# Altium schematic sheet 1_P1.schdoc
size 309 x 223 mm; Symbol: Sheet-Symbol_A4; Device: Sheet-Symbol_A4; @Page Name: P1; @Create Date: 2023-04-10; @Page Count: 1; @Page No: 1; @Project Name: CAN底盘舵机小车（步进云台）; @Schematic Name: Schematic1; @Update Date: 2023-05-09; Company: 嘉立创EDA; Page Size: A4; Version: V1.0
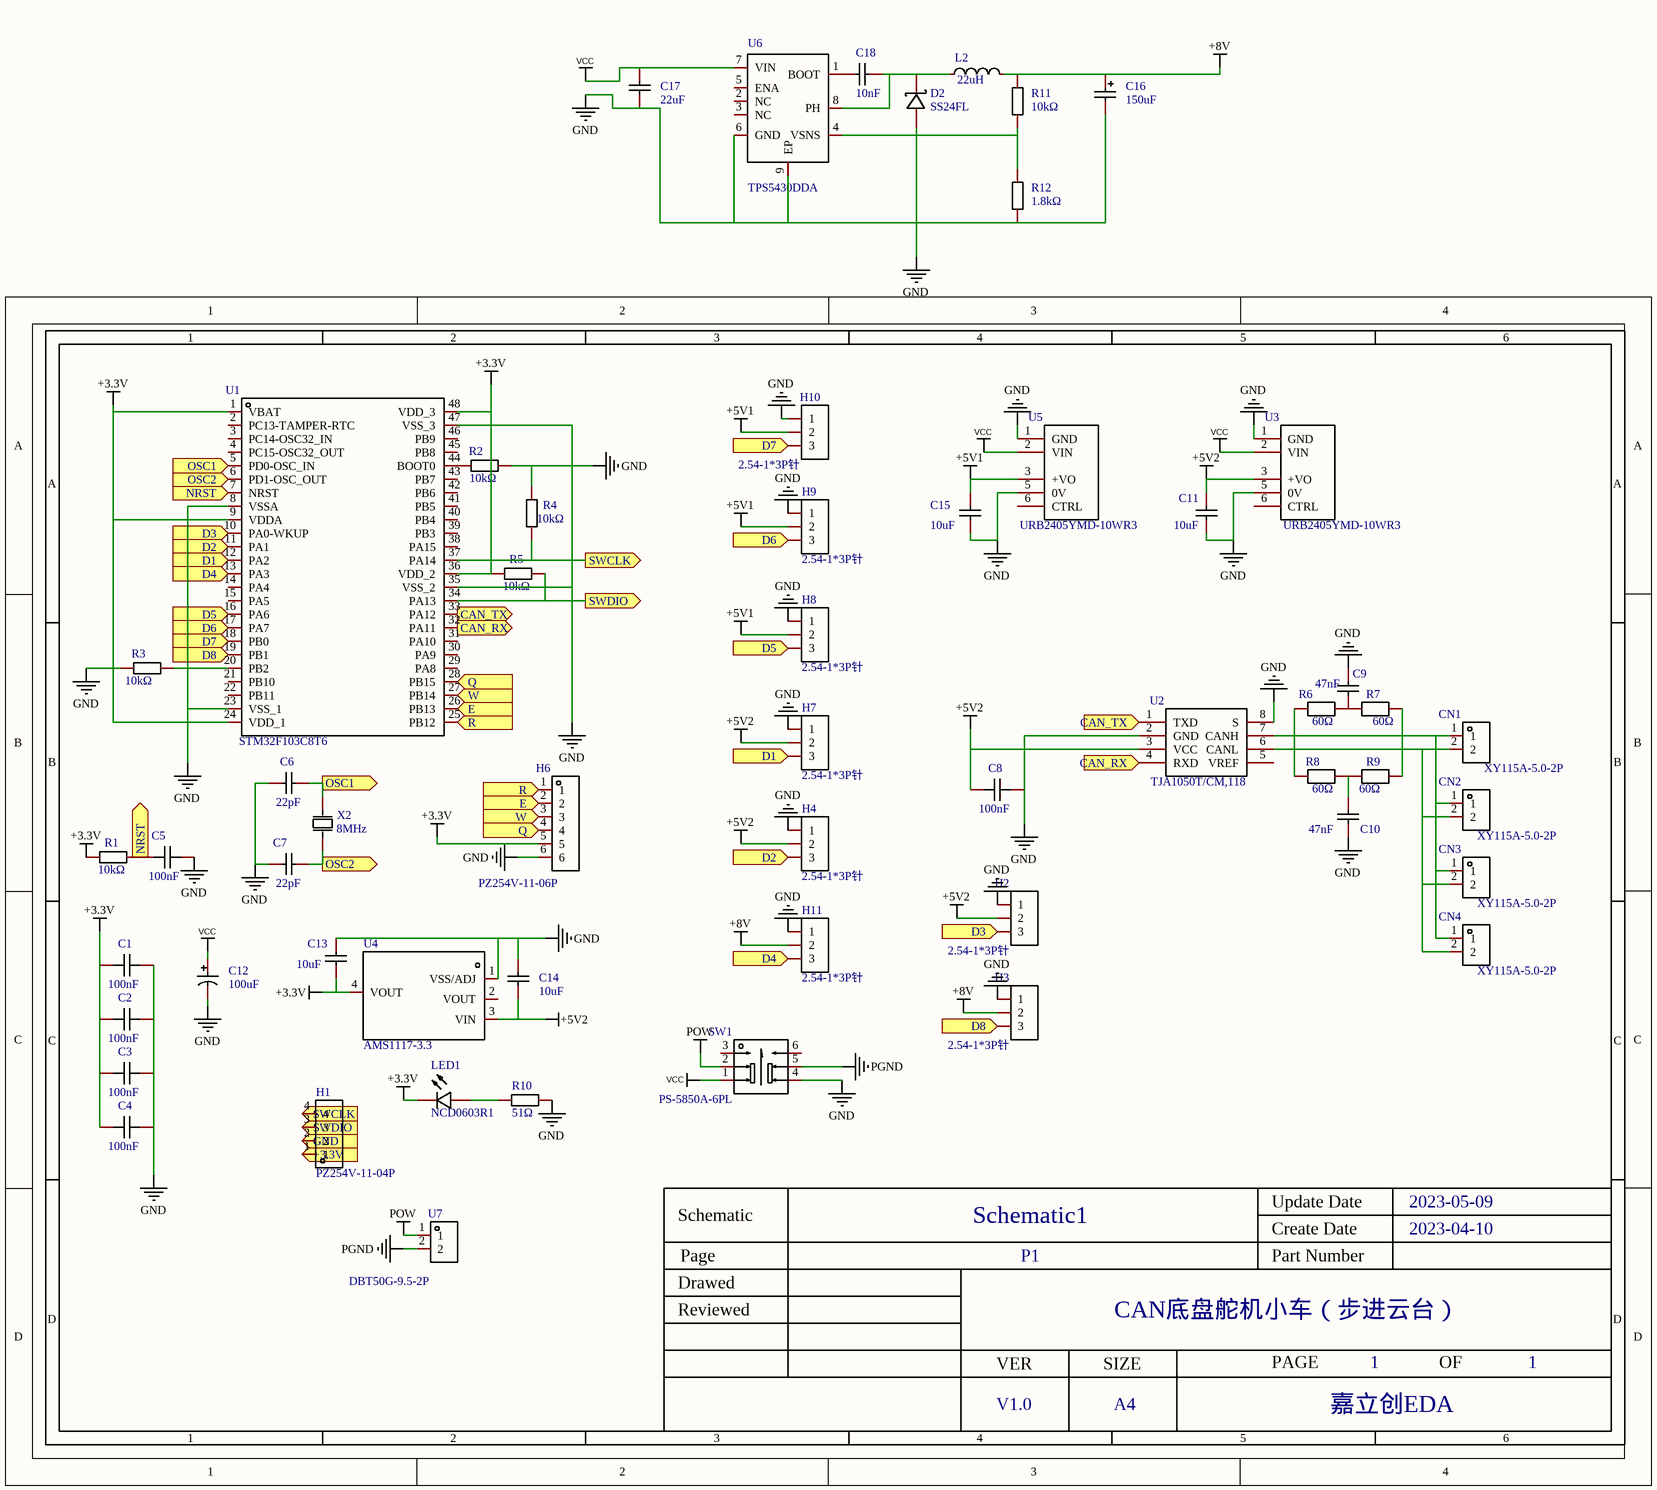
[diagram p0: 1_P1.schdoc]

## Parts
C1  100nF  [C0603]
C2  100nF  [C0603]
C3  100nF  [C0603]
C4  100nF  [C0603]
C5  100nF  [C0603]
C6  22pF  [C0603]
C7  22pF  [C0603]
C8  100nF  [C0603]
C9  47nF  [C0603]
C10  47nF  [C0603]
C11  10uF  [C1206]
C12  100uF  [CAP-TH_BD8.0-P3.50-D0.6-FD]
C13  10uF  [C1206]
C14  10uF  [C1206]
C15  10uF  [C1206]
C16  150uF  [CASE-D_7343]
C17  22uF  [C1206]
C18  10nF  [C0603]
CN1  XY115A-5.0-2P  [CONN-TH_XY115A-5.0-2P]
CN2  XY115A-5.0-2P  [CONN-TH_XY115A-5.0-2P]
CN3  XY115A-5.0-2P  [CONN-TH_XY115A-5.0-2P]
CN4  XY115A-5.0-2P  [CONN-TH_XY115A-5.0-2P]
D2  SS24FL  [SMA_L4.4-W2.8-LS5.4-RD]
H1  PZ254V-11-04P  [HDR-TH_4P-P2.54-V-M]
H2  2.54-1*3P针  [HDR-TH_3P-P2.54-V-M-1]
H3  2.54-1*3P针  [HDR-TH_3P-P2.54-V-M-1]
H4  2.54-1*3P针  [HDR-TH_3P-P2.54-V-M-1]
H6  PZ254V-11-06P  [HDR-TH_6P-P2.54-V-M]
H7  2.54-1*3P针  [HDR-TH_3P-P2.54-V-M-1]
H8  2.54-1*3P针  [HDR-TH_3P-P2.54-V-M-1]
H9  2.54-1*3P针  [HDR-TH_3P-P2.54-V-M-1]
H10  2.54-1*3P针  [HDR-TH_3P-P2.54-V-M-1]
H11  2.54-1*3P针  [HDR-TH_3P-P2.54-V-M-1]
L2  22uH  [IND-SMD_L11.5-W10.0_FXL1040]
LED1  NCD0603R1  [LED0603-FD]
R1  10kΩ  [R0603]
R2  10kΩ  [R0603]
R3  10kΩ  [R0603]
R4  10kΩ  [R0603]
R5  10kΩ  [R0603]
R6  60Ω  [R0603]
R7  60Ω  [R0603]
R8  60Ω  [R0603]
R9  60Ω  [R0603]
R10  51Ω  [R0603]
R11  10kΩ  [R0603]
R12  1.8kΩ  [R0805]
SW1  PS-5850A-6PL  [SW-TH_6P-L5.8-W5.8-P2.00-LS4.5-BL]
U1  STM32F103C8T6  [LQFP-48_L7.0-W7.0-P0.50-LS9.0-BL]
U2  TJA1050T/CM,118  [SOIC-8_L5.0-W4.0-P1.27-LS6.0-BL]
U3  URB2405YMD-10WR3  [PWRM-TH_URB2405YMD_10WR3]
U4  AMS1117-3.3  [SOT-223-3_L6.4-W3.5-P2.30-LS7.0-BR]
U5  URB2405YMD-10WR3  [PWRM-TH_URB2405YMD_10WR3]
U6  TPS5430DDA  [ESOP-8_L4.9-W3.9-P1.27-LS6.0-BL-EP-2]
U7  DBT50G-9.5-2P  [CONN-TH_2P-P9.50_DBT50G-9.5-2P]
X2  8MHz  [OSC-TH_L10.0-W4.5-P5.00]

## Ports
+3.3V (in), CAN_RX (in), CAN_RX (out), CAN_TX (in), CAN_TX (out), D1 (in), D2 (in), D3 (in), D4 (in), D5 (in), D6 (in), D7 (in), D8 (in), E (in), GND (in), NRST (in), NRST (out), OSC1 (in), OSC1 (out), OSC2 (in), OSC2 (out), Q (in), R (in), SWCLK (in), SWCLK (out), SWDIO (in), SWDIO (out), W (in)

## Nets
+3.3V: C1.1 C2.1 C3.1 C4.1 C13.2 H6.5 LED1.1(K) R1.1 R5.1 U1.1(VBAT) U1.9(VDDA) U1.24(VDD_1) U1.36(VDD_2) U1.48(VDD_3) U4.4(VOUT)
+5V1: C15.2 H8.2 H9.2 H10.2 U5.3(+VO)
+5V2: C8.1 C11.2 C14.1 H2.2 H4.2 H7.2 U2.3(VCC) U3.3(+VO) U4.3(VIN)
+8V: C16.1 H3.2 H11.2 L2.2 R11.2
GND: C1.2 C2.2 C3.2 C4.2 C5.2 C6.1 C7.1 C8.2 C9.2 C10.1 C11.1 C12.2 C13.1 C14.2 C15.1 C16.2 C17.1 D2.2(A) H2.1 H3.1 H4.1 H6.6 H7.1 H8.1 H9.1 H10.1 H11.1 R2.2 R3.1 R4.2 R10.2 R12.1 SW1.4 U1.8(VSSA) U1.23(VSS_1) U1.35(VSS_2) U1.47(VSS_3) U2.2(GND) U2.8(S) U3.1(GND) U3.5(0V) U4.1(VSS/ADJ) U5.1(GND) U5.5(0V) U6.6(GND) U6.9(EP)
PGND: SW1.5 U7.2
POW: SW1.2 U7.1
VCC: C12.1 C17.2 SW1.1 U3.2(VIN) U5.2(VIN) U6.7(VIN)
+3.3V: H1.1 ; port +3.3V  [a separate net that carries the same name]
CAN_RX: U1.32(PA11) U2.4(RXD) ; port CAN_RX
CAN_TX: U1.33(PA12) U2.1(TXD) ; port CAN_TX
D1: H7.3 U1.12(PA2) ; port D1
D2: H4.3 U1.11(PA1) ; port D2
D3: H2.3 U1.10(PA0-WKUP) ; port D3
D4: H11.3 U1.13(PA3) ; port D4
D5: H8.3 U1.16(PA6) ; port D5
D6: H9.3 U1.17(PA7) ; port D6
D7: H10.3 U1.18(PB0) ; port D7
D8: H3.3 U1.19(PB1) ; port D8
E: H6.2 U1.26(PB13) ; port E
GND: H1.2 ; port GND  [a separate net that carries the same name]
NRST: C5.1 R1.2 U1.7(NRST) ; port NRST
OSC1: C6.2 U1.5(PD0-OSC_IN) X2.1(OSC1) ; port OSC1
OSC2: C7.2 U1.6(PD1-OSC_OUT) X2.2(OSC2) ; port OSC2
Q: H6.4 U1.28(PB15) ; port Q
R: H6.1 U1.25(PB12) ; port R
SWCLK: H1.4 R4.1 U1.37(PA14) ; port SWCLK
SWDIO: H1.3 R5.2 U1.34(PA13) ; port SWDIO
W: H6.3 U1.27(PB14) ; port W
NetC9_1: C9.1 R6.2 R7.1
NetC10_2: C10.2 R8.2 R9.1
NetC18_1: C18.1 U6.1(BOOT)
NetC18_2: C18.2 D2.1(C) L2.1 U6.8(PH)
NetCN1_1: CN1.1 CN2.1 CN3.1 CN4.1 R6.1 R8.1 U2.7(CANH)
NetCN1_2: CN1.2 CN2.2 CN3.2 CN4.2 R7.2 R9.2 U2.6(CANL)
NetLED1_2: LED1.2(A) R10.1
NetR2_1: R2.1 U1.44(BOOT0)
NetR3_2: R3.2 U1.20(PB2)
NetR11_1: R11.1 R12.2 U6.4(VSNS)

Not connected (* = marked no-connect by the designer): SW1 3 6; U1 2(PC13-TAMPER-RTC) 3(PC14-OSC32_IN) 4(PC15-OSC32_OUT) 14(PA4) 15(PA5) 21(PB10) 22(PB11) 29(PA8) 30(PA9) 31(PA10) 38(PA15) 39(PB3) 40(PB4) 41(PB5) 42(PB6) 43(PB7) 45(PB8) 46(PB9); U2 5(VREF); U3 6(CTRL); U4 2(VOUT); U5 6(CTRL); U6 2(NC) 3(NC) 5(ENA)

## Notes on the sheet
- 1
- 2
- 3
- 4
- 5
- 6
- A
- B
- C
- Schematic
- Schematic1
- Create Date
- Update Date
- 2023-04-10
- 2023-05-09
- Reviewed
- Drawed
- Page
- P1
- Part Number
- CAN底盘舵机小车（步进云台）
- D
- VER
- SIZE
- PAGE
- OF
- V1.0
- A4
- 嘉立创EDA

## Library data of the parts
C1-C5 C8 = CC0603KRX7R9BB104: 容值:100nF;精度:±10%;额定电压:50V;材质(温度系数):X7R;; Manufacturer: YAGEO(国巨); Add into BOM: yes; Tolerance: ±10%; Voltage Rated: 50V; Temperature Coefficient: X7R; Name: 100nF; Symbol: CC0603KRX7R9BB104; Device: CC0603KRX7R9BB104; LCSC Part Name: 100nF ±10% 50V; Supplier Part: C14663; Manufacturer Part: CC0603KRX7R9BB104; Supplier Footprint: 0603; JLCPCB Part Class: Basic Part; Datasheet: https://atta.szlcsc.com/upload/public/pdf/source/20180910/C282072_33301C7F631E79921B82A8DAC6BCC5B3.pdf; Supplier: LCSC; Convert to PCB: yes; Value: 100nF
C6 C7 = CC0603JRNPO9BN220: 容值:22pF;精度:±5%;额定电压:50V;材质(温度系数):NP0;; Manufacturer: YAGEO(国巨); Add into BOM: yes; Tolerance: ±5%; Voltage Rated: 50V; Temperature Coefficient: NP0; Name: 22pF; Symbol: CC0603JRNPO9BN220; Device: CC0603JRNPO9BN220; LCSC Part Name: 22pF ±5% 50V; Supplier Part: C105620; Manufacturer Part: CC0603JRNPO9BN220; Supplier Footprint: 0603; JLCPCB Part Class: Extended Part; Datasheet: https://atta.szlcsc.com/upload/public/pdf/source/20170425/1493115771353.pdf; Supplier: LCSC; Convert to PCB: yes; Value: 22pF
C9 C10 = CL10B473KB8NNNC: 温度系数:X7R;精度:±10%;额定电压:50V;容值:47nF;; Manufacturer: SAMSUNG(三星); Add into BOM: yes; Temperature Coefficient: X7R; Tolerance: ±10%; Voltage Rated: 50V; Name: 47nF; Symbol: CL10B473KB8NNNC; Device: CL10B473KB8NNNC; LCSC Part Name: 47nF ±10% 50V; Supplier Part: C1622; Manufacturer Part: CL10B473KB8NNNC; Supplier Footprint: 0603; JLCPCB Part Class: Basic Part; Datasheet: https://atta.szlcsc.com/upload/public/pdf/source/20160103/1457707684971.pdf; Supplier: LCSC; Convert to PCB: yes; Value: 47nF
C11 C13-C15 = CL31A106KBHNNNE: 容值:10uF;精度:±10%;额定电压:50V;温度系数:X5R;; Manufacturer: SAMSUNG(三星); Add into BOM: yes; Tolerance: ±10%; Voltage Rated: 50V; Temperature Coefficient: X5R; Name: 10uF; Symbol: CL31A106KBHNNNE; Device: CL31A106KBHNNNE; LCSC Part Name: 10uF ±10% 50V; Supplier Part: C13585; Manufacturer Part: CL31A106KBHNNNE; Supplier Footprint: 1206; JLCPCB Part Class: Basic Part; Datasheet: https://atta.szlcsc.com/upload/public/pdf/source/20160103/1457707668742.pdf; Supplier: LCSC; Convert to PCB: yes; Value: 10uF
C12 = KM107M050F12RR0VH2FP0: 容值:100uF;精度:±20%;额定电压:50V;电容体直径:8mm;电容体长度:12mm;脚间距:3.5mm;工作寿命:2000hrs@105℃;; Manufacturer: CX(承兴); Symbol: 50V 100uF 8X12; Add into BOM: yes; Tolerance: ±20%; Rated Voltage: 50V; φD: 8mm; L: 12mm; Name: 100uF; Device: KM107M050F12RR0VH2FP0; LCSC Part Name: 100uF ±20% 50V; Supplier Part: C2749; Manufacturer Part: KM107M050F12RR0VH2FP0; Supplier Footprint: 直插,D8xL12mm; JLCPCB Part Class: Extended Part; Datasheet: https://atta.szlcsc.com/upload/public/pdf/source/20211027/06D6BA3719C264B639DC286D935D03EA.pdf; Supplier: LCSC; Convert to PCB: yes; Value: 100uF; Lead Spacing: 3.5mm; Lifetime @ Temp: 2000hrs@105℃
C16 = TAJD157K016RNJ: 容值:150uF;精度:±10%;额定电压:16V;等效串联电阻:900mΩ@100kHz;工作温度:-55~+125;; Manufacturer: Kyocera AVX; Add into BOM: yes; Tolerance: ±10%; Rated Voltage: 16V; Name: 150uF; Symbol: TAJD157K016RNJ; Device: TAJD157K016RNJ; LCSC Part Name: 150uF ±10% 16V; Supplier Part: C8025; Manufacturer Part: TAJD157K016RNJ; Supplier Footprint: CASE-D_7343; JLCPCB Part Class: Extended Part; Datasheet: https://atta.szlcsc.com/upload/public/pdf/source/20160107/1457707750243.pdf; Supplier: LCSC; Convert to PCB: yes; Value: 150uF; Equivalent Series Resistance(ESR): 900mΩ@100kHz; Operating Temperature: -55~+125
C17 = CL31A226KAHNNNE: 容值:22uF;精度:±10%;额定电压:25V;材质(温度系数):X5R;; Manufacturer: SAMSUNG(三星); Add into BOM: yes; Tolerance: ±10%; Voltage Rated: 25V; Temperature Coefficient: X5R; Name: 22uF; Symbol: CL31A226KAHNNNE; Device: CL31A226KAHNNNE; LCSC Part Name: 22uF ±10% 25V; Supplier Part: C12891; Manufacturer Part: CL31A226KAHNNNE; Supplier Footprint: 1206; JLCPCB Part Class: Basic Part; Datasheet: https://atta.szlcsc.com/upload/public/pdf/source/20160103/1457707667836.pdf; Supplier: LCSC; Convert to PCB: yes; Value: 22uF
C18 = CC0603KRX7R9BB103: 容值:10nF;精度:±10%;额定电压:50V;材质(温度系数):X7R;; Manufacturer: YAGEO(国巨); Add into BOM: yes; Tolerance: ±10%; Voltage Rated: 50V; Temperature Coefficient: X7R; Name: 10nF; Symbol: CC0603KRX7R9BB103; Device: CC0603KRX7R9BB103; LCSC Part Name: 10nF ±10% 50V; Supplier Part: C100042; Manufacturer Part: CC0603KRX7R9BB103; Supplier Footprint: 0603; JLCPCB Part Class: Extended Part; Datasheet: https://atta.szlcsc.com/upload/public/pdf/source/20180326/C100042_E8B0111D51DE3671A0A4A59FBCEFE81C.pdf; Supplier: LCSC; Convert to PCB: yes; Value: 10nF
CN1-CN4 = XY115A-5.0-2P: 间距:5mm;每排PIN数:2;排数:1;安装类型:通孔;额定电流:15A;额定电压:300V;线规 - AWG:12~28;线规 - mm²:2.5;工作温度范围:-;颜色:灰色;; Manufacturer: XINLAIYA(新莱亚); Add into BOM: yes; Pitch: 5mm; Number of PINs Per Row: 2; Current Rating (Max): 15A; Voltage Rating (Max): 300V; Wire Gauge - AWG: 12~28; Wire Gauge - mm?: 2.5; Name: XY115A-5.0-2P; Symbol: XY115A-5.0-2P; Device: XY115A-5.0-2P; LCSC Part Name: 5mm 每排P数:2 排数:1; Supplier Part: C784935; Manufacturer Part: XY115A-5.0-2P; Supplier Footprint: 直插,P=5mm; JLCPCB Part Class: Extended Part; Datasheet: https://atta.szlcsc.com/upload/public/pdf/source/20200917/C784935_3714E79DF82A203089C9C65614A10D41.pdf; Supplier: LCSC; Convert to PCB: yes; Number of Rows: 1; Mounting Style: 通孔; Operating Temperature Range: -; Color: 灰色
D2 = SS24FL_C111630: 直流反向耐压(Vr):40V;平均整流电流(Io):2A;正向压降(Vf):550mV@2A;; Manufacturer: SHIKUES(时科); Add into BOM: yes; Reverse Voltage (Vr): 40V; Average Rectified Current (Io): 2A; Name: SS24FL; Symbol: SS24FL; Device: SS24FL_C111630; LCSC Part Name: 40V 2A 550mV@2A; Supplier Part: C111630; Manufacturer Part: SS24FL; Supplier Footprint: SMAF; JLCPCB Part Class: Extended Part; Datasheet: https://atta.szlcsc.com/upload/public/pdf/source/20170721/C111630_1500622628281834580.pdf; Supplier: LCSC; Convert to PCB: yes; Forward Voltage (Vf@If): 550mV@2A
H1 = PZ254V-11-04P: 排数:单排;总PIN位数:4;间距:2.54mm;插针结构:1x4P;行距:-;安装类型:直插;圆针/方针:方针;额定电流:3A;额定电压:250V;配合针长度:6mm;塑高:2.5mm;端接针长度:3mm;触头材质:-;工作温度范围:-40℃~+105℃;颜色:黑色;; Manufacturer: XFCN(兴飞); Symbol: PZ254V-11-04P_C2691448; Add into BOM: yes; Pitch: 2.54mm; Pin Structure: 1x4P; Circluar Pins/Square Pins: 方针; Current Rating (Max): 3A; Voltage Rating (Max): 250V; Name: PZ254V-11-04P; Device: PZ254V-11-04P; LCSC Part Name: 2.54mm 1x4P 直插 方针; Supplier Part: C2691448; Manufacturer Part: PZ254V-11-04P; Supplier Footprint: 直插,P=2.54mm; JLCPCB Part Class: Extended Part; Datasheet: https://atta.szlcsc.com/upload/public/pdf/source/20200309/C492403_F9F19131791D08044AD4F84F8E751A34.pdf; Supplier: LCSC; Convert to PCB: yes; Number of Rows: 单排; Number of Pins: 4; Row Spacing: -; Mounting Type: 直插; Length of Mating Pin: 6mm; Insulation Height: 2.5mm; Length of End Connection Pin: 3mm; Contact Material: -; Operating Temperature Range: -40℃~+105℃; Color: 黑色
H2-H4 H7-H11 = 2.54-1*3P针: 排数:单排;总PIN位数:3;间距:2.54mm;插针结构:1x3P;行距:-;安装类型:直插;圆针/方针:方针;额定电流:3A;额定电压:-;配合针长度:-;塑高:-;端接针长度:-;触头材质:-;触头镀层:-;工作温度范围:-40℃~+105℃;颜色:黑色;; Manufacturer: BOOMELE(博穆精密); Symbol: Header-Male-2.54_1x3; Add into BOM: yes; Pitch: 2.54mm; Pin Structure: 1x3P; Circluar Pins/Square Pins: 方针; Current Rating (Max): 3A; Name: 2.54-1*3P针; Device: 2.54-1*3P针; LCSC Part Name: 2.54mm 1x3P 直插 方针; Supplier Part: C49257; Manufacturer Part: 2.54-1*3P针; Supplier Footprint: 插件,P=2.54mm; JLCPCB Part Class: Extended Part; Datasheet: https://atta.szlcsc.com/upload/public/pdf/source/20221018/3E9408392E35E6F57A28985E5F7BF5C9.pdf; Supplier: LCSC; Convert to PCB: yes; Number of Rows: 单排; Number of Pins: 3; Row Spacing: -; Mounting Type: 直插; Voltage Rating (Max): -; Length of Mating Pin: -; Insulation Height: -; Length of End Connection Pin: -; Contact Material: -; Contact Plating: -; Operating Temperature Range: -40℃~+105℃; Color: 黑色
H6 = PZ254V-11-06P: 排数:单排;总PIN位数:6;间距:2.54mm;插针结构:1x6P;行距:-;安装类型:直插;圆针/方针:方针;额定电流:-;额定电压:-;配合针长度:6mm;塑高:2.5mm;端接针长度:3mm;触头材质:黄铜;触头镀层:-;工作温度范围:-40℃~+105℃;颜色:黑色;; Manufacturer: XFCN(兴飞); Add into BOM: yes; Pitch: 2.54mm; Pin Structure: 1x6P; Circluar Pins/Square Pins: 方针; Name: PZ254V-11-06P; Symbol: PZ254V-11-06P; Device: PZ254V-11-06P; LCSC Part Name: 2.54mm 1x6P 直插 方针; Supplier Part: C492405; Manufacturer Part: PZ254V-11-06P; Supplier Footprint: 插件,P=2.54mm; JLCPCB Part Class: Extended Part; Datasheet: https://atta.szlcsc.com/upload/public/pdf/source/20200309/C492405_597F1930F5B55CC3C7FD95458F1C3977.pdf; Supplier: LCSC; Convert to PCB: yes; Number of Rows: 单排; Number of Pins: 6; Row Spacing: -; Mounting Type: 直插; Current Rating (Max): -; Voltage Rating (Max): -; Length of Mating Pin: 6mm; Insulation Height: 2.5mm; Length of End Connection Pin: 3mm; Contact Material: 黄铜; Contact Plating: -; Operating Temperature Range: -40℃~+105℃; Color: 黑色
L2 = MWSA1004S-220MT: 精度:±20%;直流电阻(DCR):66mΩ;电感值:22uH;额定电流:5A;; Manufacturer: Sunlord(顺络); Add into BOM: yes; Tolerance: ±20%; DC Resistance (DCR): 66mΩ; Rated Current: 5A; Name: 22uH; Symbol: MWSA1004S-220MT; Device: MWSA1004S-220MT; LCSC Part Name: 22uH ±20%; Supplier Part: C408489; Manufacturer Part: MWSA1004S-220MT; Supplier Footprint: SMD; JLCPCB Part Class: Extended Part; Datasheet: https://atta.szlcsc.com/upload/public/pdf/source/20190729/C408489_F253F332E3C036DD709DB0FBE5108DAD.pdf; Supplier: LCSC; Convert to PCB: yes; Height: 4mm; Width: 11.5mm; Length: 10mm; Value: 22uH
LED1 = NCD0603R1_C84263: 照明颜色:红色;主波长/色坐标:615~630nm;; Manufacturer: 国星光电; Symbol: FC-DA1608HRK-620D; Add into BOM: yes; Illumination Color: 红色; Luminous Intensity (IF=20mA): 80~100mcd; Name: NCD0603R1; Device: NCD0603R1_C84263; LCSC Part Name: 红灯 0603 贴片LED; Supplier Part: C84263; Manufacturer Part: NCD0603R1; Supplier Footprint: 0603; JLCPCB Part Class: Extended Part; Datasheet: https://atta.szlcsc.com/upload/public/pdf/source/20200820/C84263_DABC6A75E58F576973B407FDBA283D60.pdf; Supplier: LCSC; Convert to PCB: yes; Mounting Type: 表面贴装; Dominant Wavelength / Coordinate rank: 615~630nm
R1-R5 = RC0603FR-0710KL: 电阻类型:厚膜电阻;阻值:10kΩ;精度:±1%;功率:100mW;温度系数:±100ppm/℃;最大工作电压:75V;工作温度范围:-55℃~+155℃;; Manufacturer: YAGEO(国巨); Add into BOM: yes; Tolerance: ±1%; Power(Watts): 100mW; Overload Voltage (Max): 75V; Name: 10kΩ; Symbol: RC0603FR-0710KL; Device: RC0603FR-0710KL; LCSC Part Name: 10kΩ ±1% 100mW; Supplier Part: C98220; Manufacturer Part: RC0603FR-0710KL; Supplier Footprint: 0603; JLCPCB Part Class: Extended Part; Datasheet: https://atta.szlcsc.com/upload/public/pdf/source/20170522/1495423494387.pdf; Supplier: LCSC; Convert to PCB: yes; Type: 厚膜电阻; Value: 10kΩ; Temperature Coefficient: ±100ppm/℃; Operating Temperature Range: -55℃~+155℃
R6-R9 = RTT0360R0FTP: 电阻类型:厚膜电阻;阻值:60Ω;精度:±1%;功率:100mW;温度系数:±100ppm/℃;最大工作电压:75V;工作温度范围:-55℃~+155℃;; Manufacturer: RALEC(旺诠); Add into BOM: yes; Tolerance: ±1%; Power(Watts): 100mW; Overload Voltage (Max): 75V; Name: 60Ω; Symbol: RTT0360R0FTP; Device: RTT0360R0FTP; LCSC Part Name: 60Ω ±1% 100mW; Supplier Part: C166918; Manufacturer Part: RTT0360R0FTP; Supplier Footprint: 0603; JLCPCB Part Class: Extended Part; Datasheet: https://atta.szlcsc.com/upload/public/pdf/source/20180207/C166918_15179952804591359418.pdf; Supplier: LCSC; Convert to PCB: yes; Type: 厚膜电阻; Value: 60Ω; Temperature Coefficient: ±100ppm/℃; Operating Temperature Range: -55℃~+155℃
R10 = 0603WAF510JT5E: 精度:±1%;功率:1/10W;电阻类型:厚膜电阻;最大工作电压:75V;温度系数:±100ppm/℃;工作温度范围:-55℃~+155℃;阻值:51Ω;; Manufacturer: UNI-ROYAL(厚声); Add into BOM: yes; Tolerance: ±1%; Power(Watts): 1/10W; Overload Voltage (Max): 75V; Name: 51Ω; Symbol: 0603WAF510JT5E; Device: 0603WAF510JT5E; LCSC Part Name: 51Ω ±1%; Supplier Part: C23197; Manufacturer Part: 0603WAF510JT5E; Supplier Footprint: 0603; JLCPCB Part Class: Basic Part; Datasheet: https://atta.szlcsc.com/upload/public/pdf/source/20200306/C422600_1E6D84923E4A46A82E41ADD87F860B5C.pdf; Supplier: LCSC; Convert to PCB: yes; Type: 厚膜电阻; Temperature Coefficient: ±100ppm/℃; Operating Temperature Range: -55℃~+155℃; Value: 51Ω
R11 = 0603WAF1002T5E: 电阻类型:厚膜电阻;阻值:10kΩ;精度:±1%;功率:100mW;; Manufacturer: UNI-ROYAL(厚声); Add into BOM: yes; Tolerance: ±1%; Power(Watts): 100mW; Temperature Coefficient: ±100ppm/; Overload Voltage (Max): 75V; Name: 10kΩ; Symbol: 0603WAF1002T5E; Device: 0603WAF1002T5E; LCSC Part Name: 厚膜电阻 10kΩ ±1% 100mW; Supplier Part: C25804; Manufacturer Part: 0603WAF1002T5E; Supplier Footprint: 0603; JLCPCB Part Class: Basic Part; Datasheet: https://atta.szlcsc.com/upload/public/pdf/source/20200306/C422600_1E6D84923E4A46A82E41ADD87F860B5C.pdf; Supplier: LCSC; Convert to PCB: yes; Type: 厚膜电阻; Value: 10kΩ; Operating Temperature Range: -55~+155
R12 = 0805W8F1801T5E: 电阻类型:厚膜电阻;阻值:1.8kΩ;精度:±1%;功率:125mW;; Manufacturer: UNI-ROYAL(厚声); Add into BOM: yes; Tolerance: ±1%; Power(Watts): 125mW; Temperature Coefficient: ±100ppm/; Overload Voltage (Max): 150V; Name: 1.8kΩ; Symbol: 0805W8F1801T5E; Device: 0805W8F1801T5E; LCSC Part Name: 1.8kΩ ±1% 125mW; Supplier Part: C17398; Manufacturer Part: 0805W8F1801T5E; Supplier Footprint: 0805; JLCPCB Part Class: Basic Part; Datasheet: https://atta.szlcsc.com/upload/public/pdf/source/20200306/C422600_1E6D84923E4A46A82E41ADD87F860B5C.pdf; Supplier: LCSC; Convert to PCB: yes; Type: 厚膜电阻; Value: 1.8kΩ; Operating Temperature Range: -55~+155
SW1 = PS-5850A-6PL: 5.8自锁按键开关 高头 耐高温; Manufacturer: G-Switch(品赞); Add into BOM: yes; Name: PS-5850A-6PL; Symbol: PS-5850A-6PL; Device: PS-5850A-6PL; LCSC Part Name: 自锁按键开关; Supplier Part: C963201; Manufacturer Part: PS-5850A-6PL; Supplier Footprint: 插件,5.8x5.8x10mm; JLCPCB Part Class: Extended Part; Datasheet: https://atta.szlcsc.com/upload/public/pdf/source/20201201/C963201_9229C247AC907A82E381B4EE0BC1DEDE.pdf; Supplier: LCSC; Convert to PCB: yes; NO_CONNECT: yes
U1 = STM32F103C8T6: 工作电压:2V ~ 3.6V;主频（MAX):72MHz;; Manufacturer: ST(意法半导体); Add into BOM: yes; UART/USART: 3 USART; USB Device: 1; PWM: 13; I2C（SMBUS/PMBUS）: 2; A/D: 10x12bit; Program Memory Size: 64KB; RAM Size: 20KB; Speed: 72MHz; Number of I/O: 37; Name: STM32F103C8T6; Symbol: STM32F103C8T6; Device: STM32F103C8T6; LCSC Part Name: STM32F103C8T6; Supplier Part: C8734; Manufacturer Part: STM32F103C8T6; Supplier Footprint: LQFP-48_7x7x05P; JLCPCB Part Class: Basic Part; Datasheet: https://atta.szlcsc.com/upload/public/pdf/source/20140724/1457707174202.pdf; Supplier: LCSC; Convert to PCB: yes; Voltage - Supply (Vcc/Vdd): 2V ~ 3.6V; CAN: 1
U2 = TJA1050T/CM,118: 类型:收发器;; Manufacturer: NXP(恩智浦); Add into BOM: yes; Supply Voltage: 4.75V~5.25V; Supply Current: 50mA; Name: TJA1050T/CM,118; Symbol: TJA1050T/CM,118; Device: TJA1050T/CM,118; LCSC Part Name: TJA1050T/CM,118; Supplier Part: C6952; Manufacturer Part: TJA1050T/CM,118; Supplier Footprint: SOIC-8; JLCPCB Part Class: Basic Part; Datasheet: https://atta.szlcsc.com/upload/public/pdf/source/20140411/1457707042917.pdf; Supplier: LCSC; Convert to PCB: yes; Type: 收发器; NO_CONNECT: yes
U3 U5 = URB2405YMD-10WR3_C91825: 转换类型:DC-DC;输出路数:1;输入电压(DC):9V~36V;输出电压:5V;输出电流(最大值):2A;输出功率:10W;转换效率:83%;; Manufacturer: MORNSUN(金升阳); Add into BOM: yes; Conversion Type: DC-DC; Output Channel: 1; Input Voltage(DC): 9V~36V; Output Voltage: 5V; Output Current (Max): 2A; Output Power: 10W; Conversion Efficiency: 83%; Name: URB2405YMD-10WR3; Symbol: URB2405YMD-10WR3; Device: URB2405YMD-10WR3_C91825; LCSC Part Name: Vin=9V~36V Vout=5V 2A; Supplier Part: C91825; Manufacturer Part: URB2405YMD-10WR3; Supplier Footprint: 插件; JLCPCB Part Class: Extended Part; Datasheet: https://atta.szlcsc.com/upload/public/pdf/source/20161221/1482309942288.pdf; Supplier: LCSC; Convert to PCB: yes; Function: -; NO_CONNECT: yes
U4 = AMS1117-3.3_1: Manufacturer: HX(恒佳兴); Symbol: AMS1117-3.3_C5181460; Add into BOM: yes; Name: AMS1117-3.3; Device: AMS1117-3.3_1; LCSC Part Name: AMS1117-3.3; Supplier Part: C5181460; Manufacturer Part: AMS1117-3.3; Supplier Footprint: SOT-223; JLCPCB Part Class: Extended Part; Datasheet: https://atta.szlcsc.com/upload/public/pdf/source/20221124/A0FC4A7547BAED3AF8F477D5DCC568F8.pdf; Supplier: LCSC; Convert to PCB: yes; NO_CONNECT: yes
U6 = TPS5430DDA: 功能类型:降压型;同步整流:否;输出类型:可调;输出通道数:1;拓扑结构:降压式;输入电压:5.5V~36V;输出电压:1.221V~32.04V;输出电流(最大值):3A;开关频率:500kHz;工作温度:-40~+125@(TJ);; Manufacturer: TI(德州仪器); Add into BOM: yes; Function: 降压型; Synchronous Rectification: 否; Output Type: 可调; Number of Outputs: 1; Topology: 降压式; Output Current (Max): 3A; Switching Frequency: 500kHz; Name: TPS5430DDA; Symbol: TPS5430DDA; Device: TPS5430DDA; LCSC Part Name: 降压型 Vin=5.5V~36V Vout=1.221V~32.04V 3A; Supplier Part: C502477; Manufacturer Part: TPS5430DDA; Supplier Footprint: ESOP-8; JLCPCB Part Class: Extended Part; Datasheet: https://atta.szlcsc.com/upload/public/pdf/source/20200402/C502477_C195E9F29489A337252CB245AFB38C93.pdf; Supplier: LCSC; Convert to PCB: yes; Input Voltage: 5.5V~36V; Output Voltage: 1.221V~32.04V; Operating Temperature: -40~+125@(TJ)
U7 = DBT50G-9.5-2P: 隔板类型:带盖板;间距:9.5mm;每排PIN数:2;排数:1;安装方式:直针;引脚位置:边脚;额定电流:32A;额定电压:750V;线规 - AWG:12~22;线规 - mm2:4;工作温度范围:-40℃~+105℃;颜色:黑色;; Manufacturer: DIBO(地博电气); Add into BOM: yes; Barrier Type: 带盖板; Pitch: 9.5mm; Number of PINs Per Row: 2; Pin Location: 边脚; Current Rating (Max): 32A; Voltage Rating (Max): 750V; Wire Gauge - AWG: 12~22; Wire Gauge - mm2: 4; Name: DBT50G-9.5-2P; Symbol: DBT50G-9.5-2P; Device: DBT50G-9.5-2P; LCSC Part Name: 9.5mm 每排P数:2 排数:1 直针 边脚; Supplier Part: C395958; Manufacturer Part: DBT50G-9.5-2P; Supplier Footprint: 直插,P=9.5mm; JLCPCB Part Class: Extended Part; Datasheet: https://atta.szlcsc.com/upload/public/pdf/source/20191108/C395958_986F5ECBFA2A4F73FC4A59411446AA93.pdf; Supplier: LCSC; Convert to PCB: yes; Number of Rows: 1; Mounting Style: 直针; Operating Temperature Range: -40℃~+105℃; Color: 黑色
X2 = X49SD8MSD2SC: 频率:8MHz;频率公差:±20ppm;频率稳定度:±30ppm;负载电容:20pF;; Manufacturer: YXC(扬兴晶振); Add into BOM: yes; Crystal Type: 49S晶振; Frequency Tolerance: ±20ppm; Frequency Stability: ±30ppm; Load Capacitance: 20pF; Name: 8MHz; Symbol: X49SD8MSD2SC; Device: X49SD8MSD2SC; LCSC Part Name: 8MHz ±20ppm 20pF; Supplier Part: C21263; Manufacturer Part: X49SD8MSD2SC; Supplier Footprint: HC-49S; JLCPCB Part Class: Extended Part; Datasheet: https://atta.szlcsc.com/upload/public/pdf/source/20210903/A997D130AE99CBB55D9024F9BE6DA174.pdf; Supplier: LCSC; Convert to PCB: yes; Value: 8MHz; Operating Temperature: -20~+70